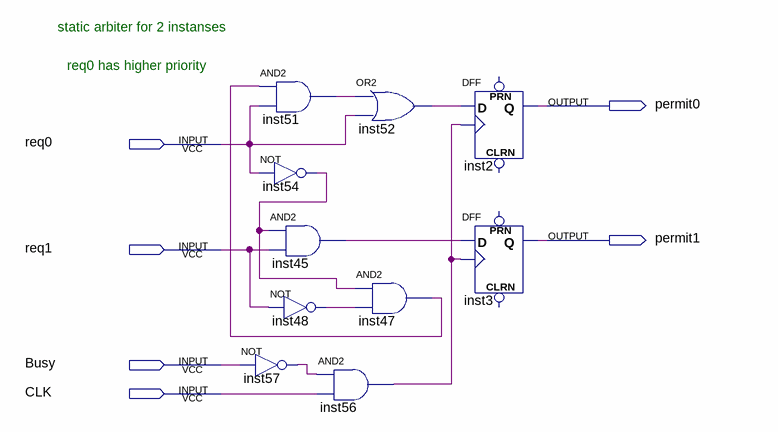
[diagram p0: schematic sheet]
// Quartus schematic arbiter.bdf as structural Verilog: 10 symbols, 6 pins
module arbiter (
  input  req0,
  input  req1,
  input  Busy,
  input  CLK,
  output permit0,
  output permit1
);

  wire inst45_out, inst47_out, inst48_out, inst51_out, inst52_out, inst54_out, inst56_out, inst57_out;

  not inst57 (inst57_out, Busy);
  and inst51 (inst51_out, inst47_out, req0);
  not inst54 (inst54_out, req0);
  and inst45 (inst45_out, inst54_out, req1);
  not inst48 (inst48_out, req1);
  and inst56 (inst56_out, inst57_out, CLK);
  or inst52 (inst52_out, inst51_out, req0);
  and inst47 (inst47_out, inst54_out, inst48_out);
  DFF inst2 (.CLK(inst56_out), .D(inst52_out), .Q(permit0));  // open: CLRN, PRN
  DFF inst3 (.CLK(inst56_out), .D(inst45_out), .Q(permit1));  // open: CLRN, PRN

  // Notes on the sheet:
  //   static arbiter for 2 instanses
  //   req0 has higher priority
endmodule
